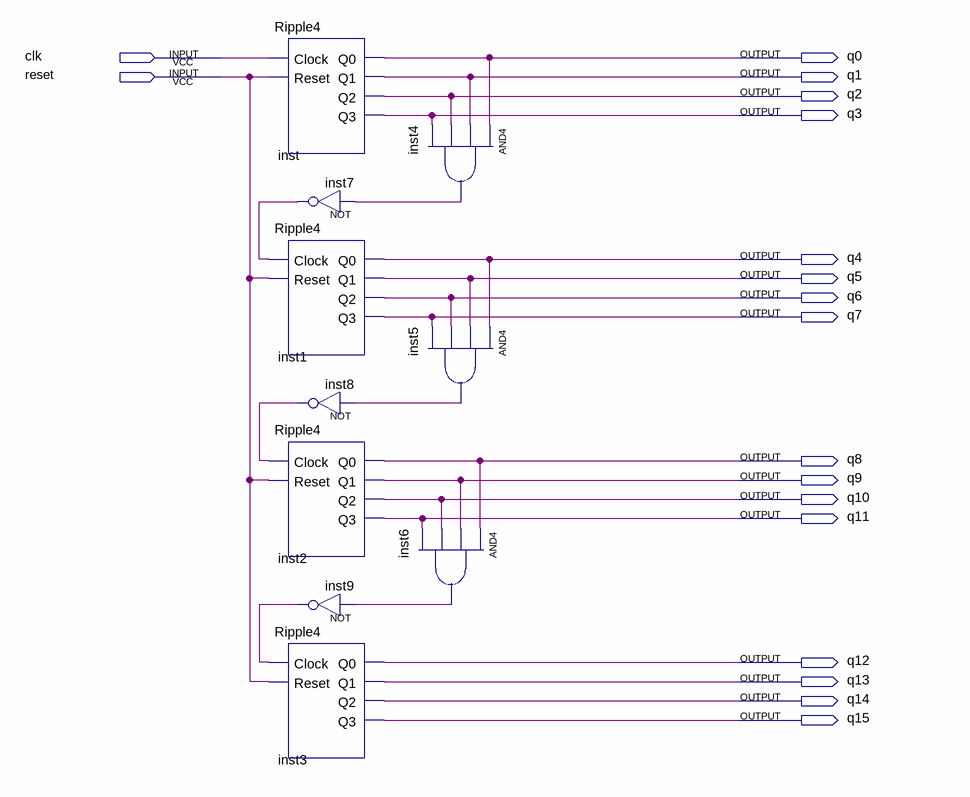
[diagram p0: schematic sheet]
// Quartus schematic Ripple16.bdf as structural Verilog: 10 symbols, 18 pins
module Ripple16 (
  input  clk,
  input  reset,
  output q0,
  output q1,
  output q2,
  output q3,
  output q4,
  output q5,
  output q6,
  output q7,
  output q8,
  output q9,
  output q10,
  output q11,
  output q12,
  output q13,
  output q14,
  output q15
);

  wire inst4_out, inst5_out, inst6_out, inst7_out, inst8_out, inst9_out;

  Ripple4 inst (.Clock(clk), .Reset(reset), .Q0(q0), .Q1(q1), .Q2(q2), .Q3(q3));
  not inst7 (inst7_out, inst4_out);
  Ripple4 inst1 (.Clock(inst7_out), .Reset(reset), .Q0(q4), .Q1(q5), .Q2(q6), .Q3(q7));
  not inst8 (inst8_out, inst5_out);
  Ripple4 inst2 (.Clock(inst8_out), .Reset(reset), .Q0(q8), .Q1(q9), .Q2(q10), .Q3(q11));
  not inst9 (inst9_out, inst6_out);
  Ripple4 inst3 (.Clock(inst9_out), .Reset(reset), .Q0(q12), .Q1(q13), .Q2(q14), .Q3(q15));
  and inst6 (inst6_out, q8, q9, q10, q11);
  and inst4 (inst4_out, q0, q1, q2, q3);
  and inst5 (inst5_out, q4, q5, q6, q7);
endmodule
